# Altium schematic sheet 016_SoC Reset & MCU.SchDoc
size 420 x 297 mm; Page Create Date: May 29, 2006; WebSite: https://www.seeedstudio.com; Variant Name: <Core Design>; Page Number: 16; Drawing: qxn; Schematic Name: BeaglePlay; Page Size: A3; Comment: Seeed Title; Page Count: 22; Page Name: 016_SoC Reset & MCU; Company: Seeed Studio; RevCode: v0.2; DsnPath: C:\Users\a0488739\Documents\GitHub\beagleplay\allegro\DVT\BEAGLEPLAYV020_220915.DSN; SchematicName: BeaglePlay; PageName: 016_SoC Reset & MCU; PageSize: A3; TopSchematic: True
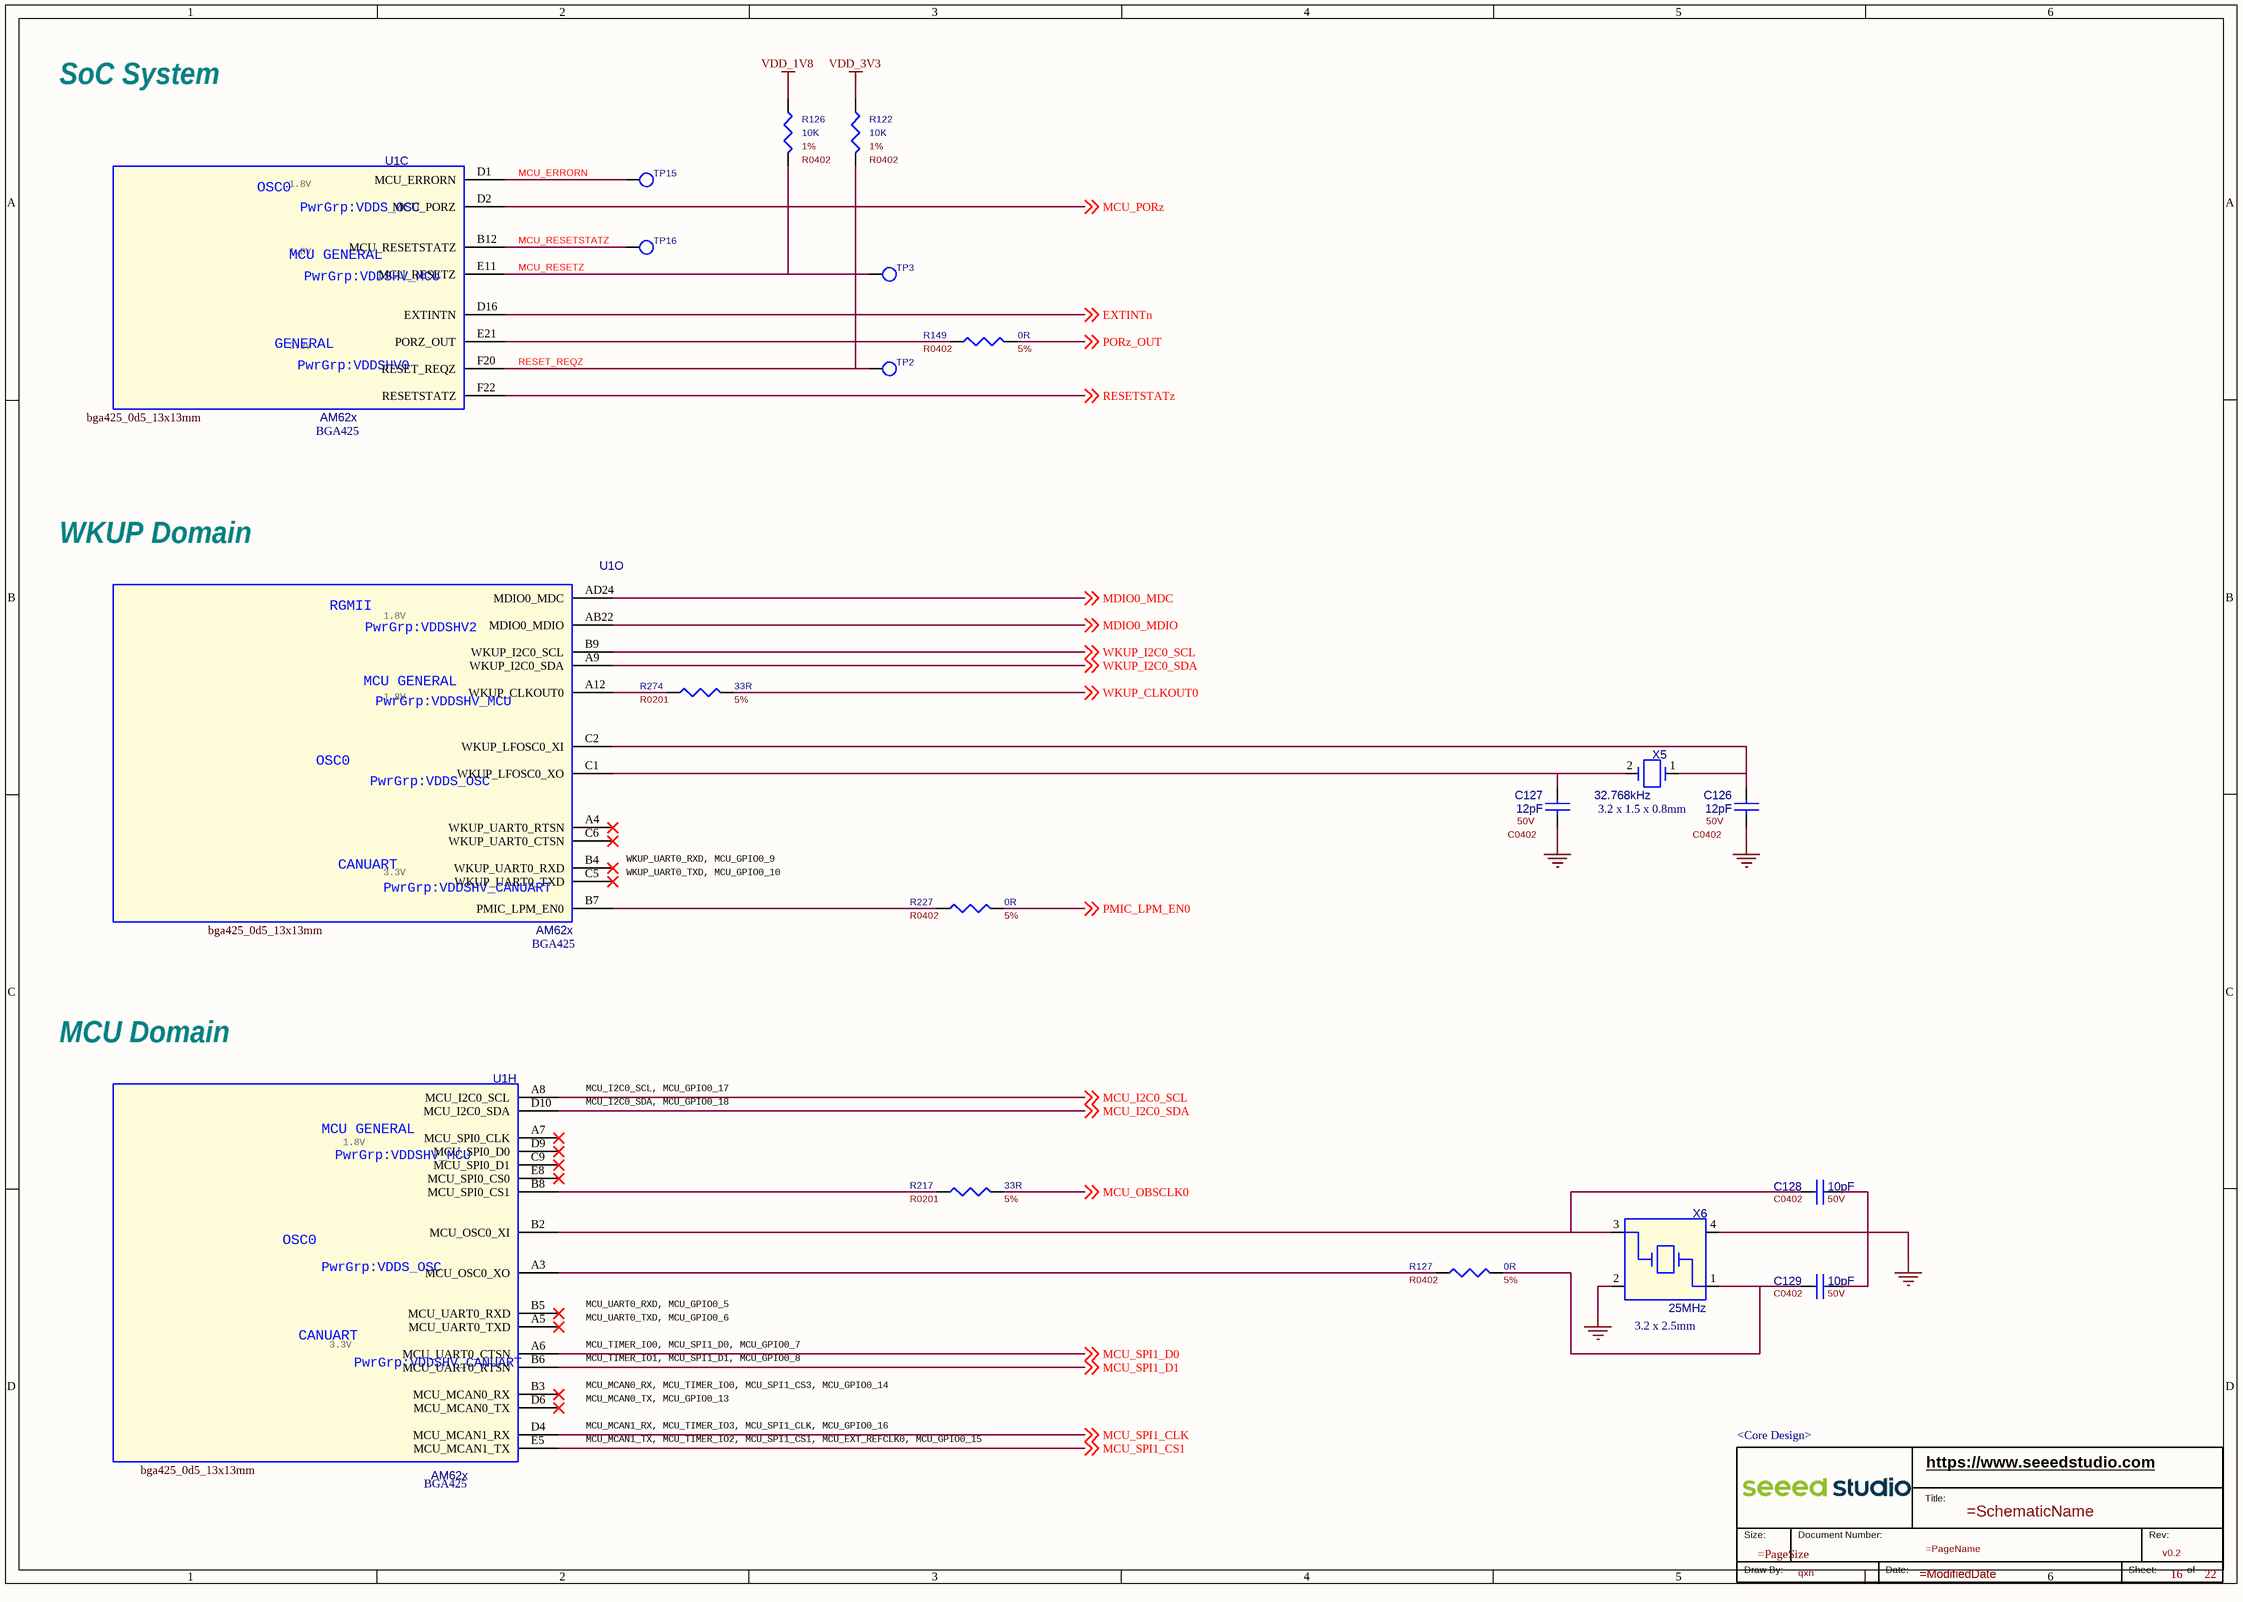
[diagram p0: 016_SoC Reset & MCU.SchDoc]

## Parts
*  RevCode: v0.2  Page Number: 16  Page Count: 22  Drawing: qxn  Variant Name: <Core Design>  (hidden comment: Seeed Title)  (graphical)
C126  value 12pF  Rating: 50V  [C0402]  (hidden comment: CC)
C127  value 12pF  Rating: 50V  [C0402]  (hidden comment: CC)
C128  value 10pF  Rating: 50V  [C0402]  (hidden comment: CC)
C129  value 10pF  Rating: 50V  [C0402]  (hidden comment: CC)
R122  value 10K  Rating: 1%  [R0402]  (hidden comment: R)
R126  value 10K  Rating: 1%  [R0402]  (hidden comment: R)
R127  value 0R  Rating: 5%  [R0402]  (hidden comment: R)
R149  value 0R  Rating: 5%  [R0402]  (hidden comment: R)
R217  value 33R  Rating: 5%  [R0201]  (hidden comment: R)
R227  value 0R  Rating: 5%  [R0402]  (hidden comment: R)
R274  value 33R  Rating: 5%  [R0201]  (hidden comment: R)
TP2  Test Point  [tp1-8040]  (value not drawn)
TP3  Test Point  [tp1-8040]  (value not drawn)
TP15  Test Point  [tp1-8040]  (value not drawn)
TP16  Test Point  [tp1-8040]  (value not drawn)
U1  value AM62x  Package Size: BGA425  [bga425_0d5_13x13mm]  (hidden comment: AM62x_BGA425)  (parts C,H,O of 19)
X5  value 32.768kHz  Package Size: 3.2 x 1.5 x 0.8mm  [X2_SMD_3_2X1_5MM]  (hidden comment: XTAL_2P)
X6  value 25MHz  Package Size: 3.2 x 2.5mm  [X4-SMD-3_2X2_5X1_0MM]  (hidden comment: XTAL_4P)

## Nets
GND: C126.2 C127.2 C128.2 C129.2 X6.2 X6.4
VDD_1V8: R126.1
VDD_3V3: R122.1
EXTINTn: U1.D16(EXTINTN) ; off-sheet EXTINTn
MCU_ERRORN: TP15.1(TP) U1.D1(MCU_ERRORN)
MCU_I2C0_SCL: U1.A8(MCU_I2C0_SCL) ; off-sheet MCU_I2C0_SCL
MCU_I2C0_SDA: U1.D10(MCU_I2C0_SDA) ; off-sheet MCU_I2C0_SDA
MCU_OBSCLK0: R217.2 ; off-sheet MCU_OBSCLK0
MCU_PORz: U1.D2(MCU_PORZ) ; off-sheet MCU_PORz
MCU_RESETSTATZ: TP16.1(TP) U1.B12(MCU_RESETSTATZ)
MCU_RESETZ: R126.2 TP3.1(TP) U1.E11(MCU_RESETZ)
MCU_SPI1_CLK: U1.D4(MCU_MCAN1_RX) ; off-sheet MCU_SPI1_CLK
MCU_SPI1_CS1: U1.E5(MCU_MCAN1_TX) ; off-sheet MCU_SPI1_CS1
MCU_SPI1_D0: U1.A6(MCU_UART0_CTSN) ; off-sheet MCU_SPI1_D0
MCU_SPI1_D1: U1.B6(MCU_UART0_RTSN) ; off-sheet MCU_SPI1_D1
MDIO0_MDC: U1.AD24(MDIO0_MDC) ; off-sheet MDIO0_MDC
MDIO0_MDIO: U1.AB22(MDIO0_MDIO) ; off-sheet MDIO0_MDIO
PMIC_LPM_EN0: R227.2 ; off-sheet PMIC_LPM_EN0
PORz_OUT: R149.2 ; off-sheet PORz_OUT
RESET_REQZ: R122.2 TP2.1(TP) U1.F20(RESET_REQZ)
RESETSTATz: U1.F22(RESETSTATZ) ; off-sheet RESETSTATz
WKUP_CLKOUT0: R274.2 ; off-sheet WKUP_CLKOUT0
WKUP_I2C0_SCL: U1.B9(WKUP_I2C0_SCL) ; off-sheet WKUP_I2C0_SCL
WKUP_I2C0_SDA: U1.A9(WKUP_I2C0_SDA) ; off-sheet WKUP_I2C0_SDA
NetC126_1: C126.1 U1.C2(WKUP_LFOSC0_XI) X5.1
NetC127_1: C127.1 U1.C1(WKUP_LFOSC0_XO) X5.2
NetC128_1: C128.1 U1.B2(MCU_OSC0_XI) X6.3
NetC129_1: C129.1 R127.2 X6.1
NetR127_1: R127.1 U1.A3(MCU_OSC0_XO)
NetR149_1: R149.1 U1.E21(PORZ_OUT)
NetR217_1: R217.1 U1.B8(MCU_SPI0_CS1)
NetR227_1: R227.1 U1.B7(PMIC_LPM_EN0)
NetR274_1: R274.1 U1.A12(WKUP_CLKOUT0)

Not connected (* = marked no-connect by the designer): U1 A4(WKUP_UART0_RTSN)* A5(MCU_UART0_TXD)* A7(MCU_SPI0_CLK)* B3(MCU_MCAN0_RX)* B4(WKUP_UART0_RXD)* B5(MCU_UART0_RXD)* C5(WKUP_UART0_TXD)* C6(WKUP_UART0_CTSN)* C9(MCU_SPI0_D1)* D6(MCU_MCAN0_TX)* D9(MCU_SPI0_D0)* E8(MCU_SPI0_CS0)*

## Notes on the sheet
- SoC System
- 1.8V
- 3.3V
- WKUP Domain
- WKUP_UART0_RXD, MCU_GPIO0_9
- WKUP_UART0_TXD, MCU_GPIO0_10
- MCU Domain
- MCU_I2C0_SCL, MCU_GPIO0_17
- MCU_I2C0_SDA, MCU_GPIO0_18
- MCU_UART0_RXD, MCU_GPIO0_5
- MCU_UART0_TXD, MCU_GPIO0_6
- MCU_TIMER_IO1, MCU_SPI1_D1, MCU_GPIO0_8
- MCU_TIMER_IO0, MCU_SPI1_D0, MCU_GPIO0_7
- MCU_MCAN0_RX, MCU_TIMER_IO0, MCU_SPI1_CS3, MCU_GPIO0_14
- MCU_MCAN0_TX, MCU_GPIO0_13
- MCU_MCAN1_TX, MCU_TIMER_IO2, MCU_SPI1_CS1, MCU_EXT_REFCLK0, MCU_GPIO0_15
- MCU_MCAN1_RX, MCU_TIMER_IO3, MCU_SPI1_CLK, MCU_GPIO0_16
- (in symbol AM62x_BGA425, part C) OSC0; PwrGrp:VDDS_OSC; MCU GENERAL; PwrGrp:VDDSHV_MCU; GENERAL; PwrGrp:VDDSHV0
- (in symbol AM62x_BGA425, part H) MCU GENERAL; PwrGrp:VDDSHV_MCU; OSC0; PwrGrp:VDDS_OSC; CANUART; PwrGrp:VDDSHV_CANUART
- (in symbol AM62x_BGA425, part O) RGMII; PwrGrp:VDDSHV2; MCU GENERAL; PwrGrp:VDDSHV_MCU; OSC0; PwrGrp:VDDS_OSC; CANUART; PwrGrp:VDDSHV_CANUART
- (in symbol Seeed Title) https://www.seeedstudio.com; Title:; Size:; Document Number:; Rev:; Draw By:; Date:; Sheet:; of

## Library data of the parts
* = Seeed Title: Company: Seeed Studio; WebSite: https://www.seeedstudio.com; Schematic Name: =SchematicName; Page Size: =PageSize; Page Name: =PageName; Page Create Date: May 29, 2006; Page Modify Date: =ModifiedDate
C126 = CC: CAP, Ceramic, SMD, 12pF, 5%, 50V, 0402; Part Reference: C126; Manufacturer Part Number: CC0402JRNPO9BN120; Manufacturer: YAGEO; Company Part Status: BeaglePlay; PN: 302010049; Temperature Coefficient: NPO; CLASS: DISCRETE; PCB Footprint: C0402; Temperature: -55¡ãC to 125¡ãC; Status: Testo PoE; Part Type: Ceramic; Package Size: 0402; Dielectric Type: Ceramic; Tolerance: 5%; Manufacturer PN: CC0402JRNPO9BN120
C127 = CC: CAP, Ceramic, SMD, 12pF, 5%, 50V, 0402; Part Reference: C127; Manufacturer PN: CC0402JRNPO9BN120; Company Part Status: BeaglePlay; Manufacturer: YAGEO; CLASS: DISCRETE; Temperature Coefficient: NPO; PN: 302010049; PCB Footprint: C0402; Tolerance: 5%; Dielectric Type: Ceramic; Package Size: 0402; Temperature: -55¡ãC to 125¡ãC; Status: Testo PoE; Part Type: Ceramic; Manufacturer Part Number: CC0402JRNPO9BN120
C128 = CC: CAP, Ceramic, SMD, 10pF, 5%, 50V, 0402; Part Reference: C128; Manufacturer PN: CC0402JRNPO9BN100; Manufacturer: YAGEO; Company Part Status: BeagleBone Carrier Board; CLASS: DISCRETE; Temperature Coefficient: NPO; PN: 302010001; PCB Footprint: C0402; Tolerance: 5%; Dielectric Type: Ceramic; Package Size: 0402
C129 = CC: CAP, Ceramic, SMD, 10pF, 5%, 50V, 0402; Part Reference: C129; Manufacturer PN: CC0402JRNPO9BN100; Manufacturer: YAGEO; Company Part Status: BeagleBone Carrier Board; CLASS: DISCRETE; Temperature Coefficient: NPO; PN: 302010001; PCB Footprint: C0402; Tolerance: 5%; Dielectric Type: Ceramic; Package Size: 0402
R122 = R: RES, Thick Film, 10K, 1%, 1/16W, SMD, 0402; Part Reference: R122; Manufacturer PN: RC0402FR-0710KL; Manufacturer: YAGEO; Company Part Status: BeagleBone Carrier Board; CLASS: DISCRETE; PN: 301010047; PCB Footprint: R0402; Rated Power: 1/16W; Package Size: 0402
R126 = R: RES, Thick Film, 10K, 1%, 1/16W, SMD, 0402; Part Reference: R126; Manufacturer PN: RC0402FR-0710KL; Manufacturer: YAGEO; Company Part Status: BeagleBone Carrier Board; CLASS: DISCRETE; PN: 301010047; PCB Footprint: R0402; Rated Power: 1/16W; Package Size: 0402
R127 = R: RES, Thick Film, 0R, 5%, 1/16W, SMD, 0402; Part Reference: R127; Manufacturer PN: RC0402JR-070RL; Manufacturer: YAGEO; Company Part Status: BeagleBone Carrier Board; CLASS: DISCRETE; PN: 301010000; PCB Footprint: R0402; Rated Power: 1/16W; Package Size: 0402
R149 = R: RES, Thick Film, 0R, 5%, 1/16W, SMD, 0402; Part Reference: R149; Company Part Status: BeagleBone Carrier Board; Manufacturer: YAGEO; Manufacturer PN: RC0402JR-070RL; PN: 301010000; CLASS: DISCRETE; PCB Footprint: R0402; Package Size: 0402; Rated Power: 1/16W
R217 = R: RES, Thick Film, 33R, 5%, 1/20W, SMD, 0201; Part Reference: R217; Manufacturer PN: RC0201JR-0733RL; Manufacturer: YAGEO; Company Part Status: BeagleBone Carrier Board; CLASS: DISCRETE; PN: 301010675; PCB Footprint: R0201; Rated Power: 1/20W; Package Size: 0201
R227 = R: RES, Thick Film, 0R, 5%, 1/16W, SMD, 0402; Part Reference: R227; Manufacturer PN: RC0402JR-070RL; Manufacturer: YAGEO; Company Part Status: BeagleBone Carrier Board; CLASS: DISCRETE; PN: 301010000; PCB Footprint: R0402; Rated Power: 1/16W; Package Size: 0402
R274 = R: RES, Thick Film, 33R, 5%, 1/20W, SMD, 0201; Part Reference: R274; Manufacturer PN: RC0201JR-0733RL; Manufacturer: YAGEO; Company Part Status: BeagleBone Carrier Board; CLASS: DISCRETE; PN: 301010675; PCB Footprint: R0201; Rated Power: 1/20W; Package Size: 0201
TP2 = Test Point: MISC, Test Point, Test Point, SMD, TP35S_SMD; Part Reference: TP2; Company Part Status: Mini-Gateway; ASSY: DNP; CLASS: DISCRETE; PCB Footprint: TP35S_SMD; Value: Test Point; Package Size: TP35S_SMD; PN: TP35S_SMD
TP3 = Test Point: MISC, Test Point, Test Point, SMD, TP35S_SMD; Part Reference: TP3; Company Part Status: Mini-Gateway; ASSY: DNP; CLASS: DISCRETE; PCB Footprint: TP35S_SMD; Value: Test Point; PN: TP35S_SMD; Package Size: TP35S_SMD
TP15 = Test Point: MISC, Test Point, Test Point, SMD, TP35S_SMD; Part Reference: TP15; Company Part Status: Mini-Gateway; ASSY: DNP; CLASS: DISCRETE; PCB Footprint: TP35S_SMD; Value: Test Point; PN: TP35S_SMD; Package Size: TP35S_SMD
TP16 = Test Point: MISC, Test Point, Test Point, SMD, TP35S_SMD; Part Reference: TP16; Company Part Status: Mini-Gateway; ASSY: DNP; CLASS: DISCRETE; PCB Footprint: TP35S_SMD; Value: Test Point; Package Size: TP35S_SMD; PN: TP35S_SMD
U1 = AM62x_BGA425: IC, Controller, MPU, AM62x, BGA425; Part Reference: U1; Manufacturer PN: AM6254ATCGGHALWR; Manufacturer: TI; Company Part Status: BeaglePlay; PN: 310011537; PCB Footprint: bga425_0d5_13x13mm; CLASS: IC
X5 = XTAL_2P: Crystal, SMD, 32.768kHz, 20 ppm, 7pF; Part Reference: X5; Manufacturer PN: FC-135 32.768KA-AG0; Company Part Status: Combox Pro; Manufacturer: EPSON; CLASS: DISCRETE; Frequency Tolerance: 20 ppm; Rating: 20ppm; PN: 306011026; PCB Footprint: X2_SMD_3_2X1_5MM; Temperature: -40¡ãC to 85¡ãC; Status: Zola Dongle; Part Type: Crystal; Manufacturer Part Number: FC-135 32.768KA-AG0
X6 = XTAL_4P: Crystal, SMD, 25MHz, 10 ppm, 8pF; Part Reference: X6; Company Part Status: RV PI; Manufacturer: Interquip; Manufacturer PN: 5YAA25000081TF30Q2; PN: 306011162; Frequency Tolerance: 10 ppm; CLASS: DISCRETE; PCB Footprint: X4-SMD-3_2X2_5X1_0MM